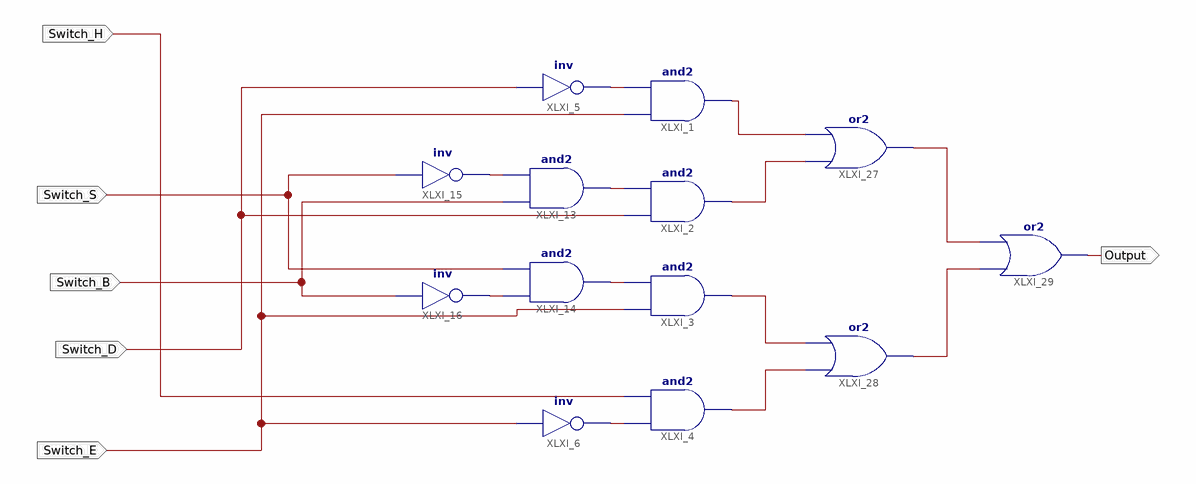
[diagram p0: schematic sheet 1]
// Xilinx ISE schematic FPAG_lab05.sch (spartan6) as structural Verilog: 13 symbols, 6 ports
module FPAG_lab05 (
  input  Switch_H,
  input  Switch_B,
  input  Switch_S,
  input  Switch_D,
  input  Switch_E,
  output Output
);

  wire XLXN_1, XLXN_2, XLXN_8, XLXN_9, XLXN_10, XLXN_11, XLXN_36, XLXN_37, XLXN_38, XLXN_39, XLXN_40, XLXN_44;

  not XLXI_16 (XLXN_11, Switch_B);
  not XLXI_15 (XLXN_10, Switch_S);
  and XLXI_14 (XLXN_9, XLXN_11, Switch_S);
  and XLXI_13 (XLXN_8, Switch_B, XLXN_10);
  not XLXI_6 (XLXN_2, Switch_E);
  not XLXI_5 (XLXN_1, Switch_D);
  and XLXI_4 (XLXN_39, XLXN_2, Switch_H);
  and XLXI_3 (XLXN_38, Switch_E, XLXN_9);
  and XLXI_2 (XLXN_37, Switch_D, XLXN_8);
  and XLXI_1 (XLXN_36, Switch_E, XLXN_1);
  or XLXI_27 (XLXN_40, XLXN_37, XLXN_36);
  or XLXI_28 (XLXN_44, XLXN_39, XLXN_38);
  or XLXI_29 (Output, XLXN_44, XLXN_40);
endmodule
